# Altium schematic sheet Sheet.SchDoc
size A
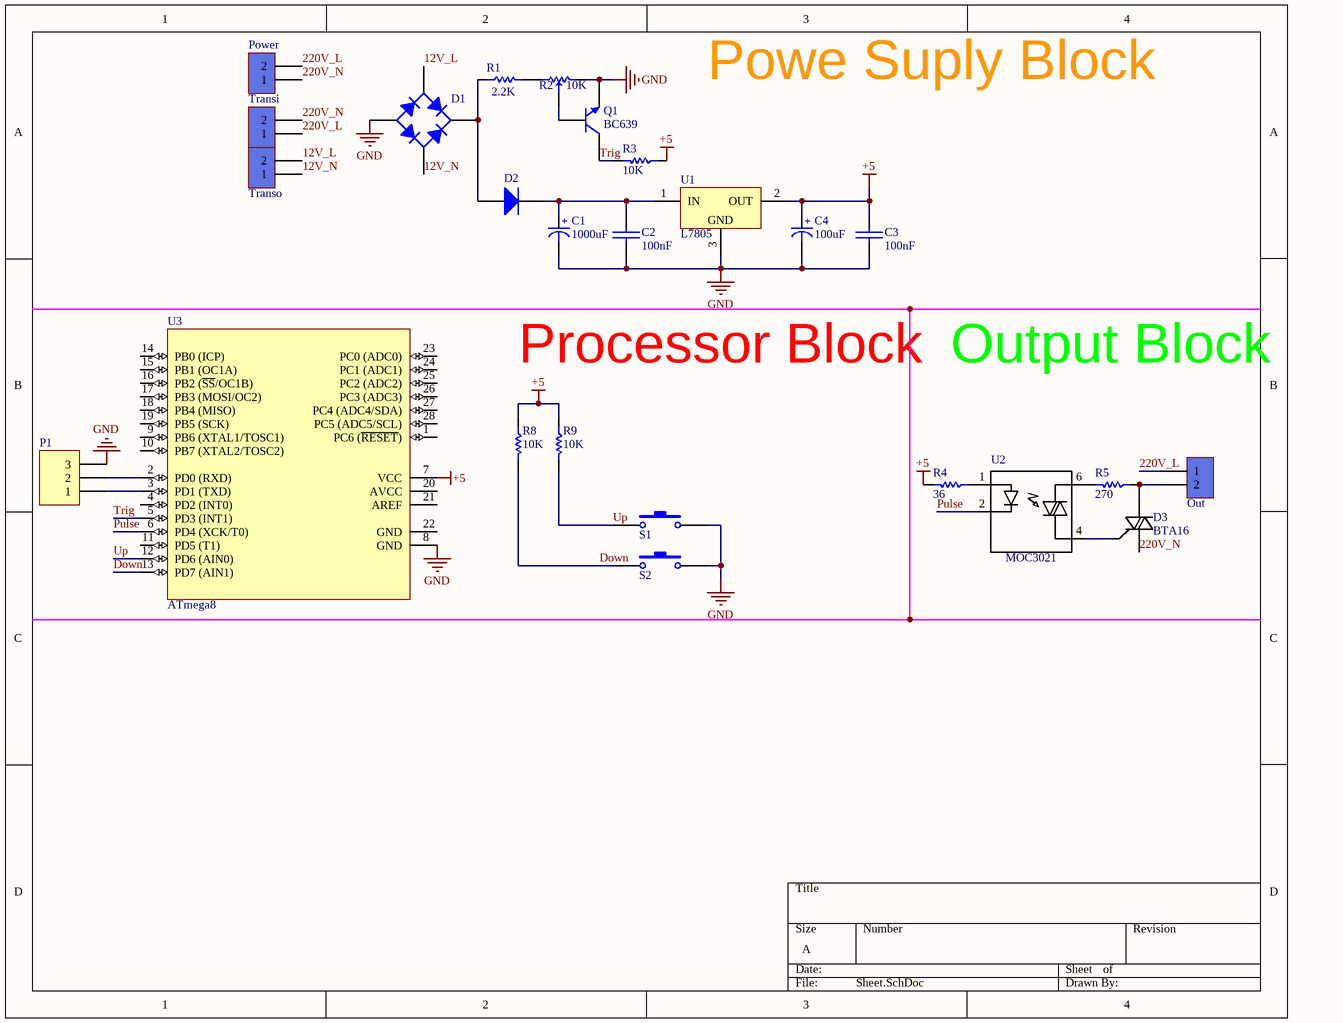
[diagram p0: Sheet.SchDoc]

## Parts
C1  1000uF  [cap 04]
C2  100nF  [Cap - 100nF]
C3  100nF  [Cap - 100nF]
C4  100uF  [cap 03]
D1  Diode Bridge  [Bridge]  (value not drawn)
D2  Diode 1N4007  [DO-41]  (value not drawn)
D3  BTA16  [*TO254P1028X482X1968-3]
Out  Terminal  [Terminal 1*2]  (value not drawn)
P1  MHDR1X3  [MHDR1X3]  (value not drawn)
Power  Terminal  [Terminal 1*2]  (value not drawn)
Q1  BC639  [C945]
R1  2.2K  [Res-(1/4)]
R2  10K  [Pot 00]
R3  10K  [Res-(1/4)]
R4  36  [Res-(1/4)]
R5  270  [Res-(1/4)]
R8  10K  [Res-(1/4)]
R9  10K  [Res-(1/4)]
S1  Switch PB  [Switch - Push to On]  (value not drawn)
S2  Switch PB  [Switch - Push to On]  (value not drawn)
Transi  Terminal  [Terminal 1*2]  (value not drawn)
Transo  Terminal  [Terminal 1*2]  (value not drawn)
U1  L7805  [78XXCV]
U2  MOC3021  [*DIP762W45P254L889H508Q6]
U3  ATmega8  [28P3]

## Nets
+5: C3.1(+) C4.1(+) R3.1 R4.2 R8.1 R9.1 U1.2(OUT) U3.7(VCC)
GND: C1.2(-) C2.2(-) C3.2(-) C4.2(-) D1.3(A) P1.3 Q1.1(E) R2.1(CCW) S1.2 S2.2 U1.3(GND) U3.8(GND)
12V_L: D1.4(C) Transo.2
12V_N: D1.2(C) Transo.1
220V_L: Out.1 Power.2 Transi.1
220V_N: D3.1(MT1) Power.1 Transi.2
Down: R8.2 S2.1 U3.13(PD7_(AIN1))
Pulse: U2.2(CATODE) U3.6(PD4_(XCK/T0))
Trig: Q1.2(C) R3.2 U3.5(PD3_(INT1))
Up: R9.2 S1.1 U3.12(PD6_(AIN0))
NetC1_1: C1.1(+) C2.1(+) D2.2(K) U1.1(IN)
NetD1_1: D1.1(K) D2.1(A) R1.1
NetD3_2: D3.2(MT2) Out.2 R5.1
NetD3_3: D3.3(G) U2.4(MAIN_TERM2)
NetP1_1: P1.1 U3.3(PD1_(TXD))
NetP1_2: P1.2 U3.2(PD0_(RXD))
NetQ1_3: Q1.3(B) R2.3(Setpoint)
NetR1_2: R1.2 R2.2(CW)
NetR4_1: R4.1 U2.1(ANODE)
NetR5_2: R5.2 U2.6(MAIN_TERM1)

Not connected (* = marked no-connect by the designer): U3 1(PC6_(~{RESET})) 4(PD2_(INT0)) 9(PB6_(XTAL1/TOSC1)) 10(PB7_(XTAL2/TOSC2)) 11(PD5_(T1)) 14(PB0_(ICP)) 15(PB1_(OC1A)) 16(PB2_(~{SS}/OC1B)) 17(PB3_(MOSI/OC2)) 18(PB4_(MISO)) 19(PB5_(SCK)) 20(AVCC) 21(AREF) 22(GND) 23(PC0_(ADC0)) 24(PC1_(ADC1)) 25(PC2_(ADC2)) 26(PC3_(ADC3)) 27(PC4_(ADC4/SDA)) 28(PC5_(ADC5/SCL))

## Notes on the sheet
- Powe Suply Block
- Processor Block
- Output Block

## Library data of the parts
C1 C4 = Cap-Polar: Polar Capacitor; Designer: Saeid Jorablo; Organazation: ControTec; Voltage: 25V; Adding Date: 1387/12/20
  C1: Value: 1000uF
  C4: Value: 100uF
C2 C3 = Cap-Bipolar: Bipolar Capacitor; Voltage: 100V; Designer: Saeid Jorablo; Organazation: ControTec; Adding Date: 1387/12/20; Value: 100nF
D1 = Diode Bridge: Full Wave Diode Bridge; Company: E.P.I.L; Design Date: 2011/11/02
D2 = Diode 1N4007: 1 Amp General Purpose Rectifier; Published: 8-Jun-2000; LatestRevisionDate: 17-Jul-2002; LatestRevisionNote: Re-released for DXP Platform.; DatasheetVersion: 1998; PackageVersion: Aug-1999; PackageReference: DO-41; Publisher: Altium Limited; PackageDescription: Diode, Axial; Body 5.2 x 2.7 mm (LxDia. max), Lead Dia. 0.86 mm (max); Code_JEDEC: DO-204-AL; ComponentLink1Description: Manufacturer Link; ComponentLink1URL: http://www.fairchildsemi.com/; ComponentLink2Description: Datasheet; ComponentLink2URL: http://www.fairchildsemi.com/ds/1N%2F1N4001.pdf
D3 = BTA16-600CW3G: Thyristor TRIAC 600V 170A 3-Pin_3+Tab_ TO-220AB Tube; MF: Littelfuse Inc.; Package: TO-220 Littelfuse; MP: BTA16-600CW3G; Availability: Unavailable; Price: None; SnapEDA_Link: https://www.snapeda.com/parts/BTA16-600CW3G/Littelfuse%20Inc./view-part/?ref=snap; Value: *
Out Power Transi Transo = Terminal 1*2: Terminal 2 Pin 250VAC 16A; Designer: Seyed Mohsen Ghasemain; E-mail: picpars@gmail.com; ComponentLinkURL: www.picpars.com
P1 = MHDR1X3: Header, 3-Pin; LatestRevisionDate: 17-Jul-2002; LatestRevisionNote: Re-released for DXP Platform.; Publisher: Altium Limited
Q1 = C945: NPN Transistor; Designer: Saeid Jorablo; Company: IPA CO; Last Update Time: 2008/08/04; Value: BC639
R1 R3-R5 R8 R9 = Resistor: Tolerance: 5%; Power: 1/8 W
  R1: Value: 2.2K
  R3 R8 R9: Value: 10K
  R4: Value: 36
  R5: Value: 270
R2 = Resistor Variable: Variable Resistor; Designer: Saeid Jorablo; Company: ControTec; Adding Date: 137/12/22; Value: 10K
S1 S2 = Switch PB: Push Button Switch
U1 = L78XXCV: Fixed Voltage Regulator; Designer: Saeid Jorablo; Company: ControTec; Adding Date: 1387/01/06; Voltage: *
U2 = MOC3021: Optoisolator Triac Output 5300Vrms 1 Channel 6-DIP; MF: ON Semiconductor; Price: None; SnapEDA_Link: https://www.snapeda.com/parts/MOC3021/ON%20Semiconductor/view-part/1666329/?ref=snap; MP: MOC3021; Availability: Unavailable; Package: DIP-6 Fujitsu; Value: *
U3 = ATmega8-16PC: 8-Bit AVR Microcontroller with 8K Bytes of In-System Programmable Flash Memory; Published: 17-Sep-2003; DatasheetVersion: 2486H-AVR-09/02; PackageVersion: revB, Sep-2001; PackageReference: 28P3; Publisher: Altium Limited; PackageDescription: 28-lead (0.300"/7.62mm Wide) Plastic Dual Inline Package (PDIP); Supplier 1: Digi-Key; Supplier Part Number 1: ATMEGA8-16PC-ND; Supplier 2: Mouser; Supplier Part Number 2: 556-ATMEGA8-16PC; ComponentLink1Description: Datasheet; ComponentLink1URL: http://www.atmel.com/dyn/resources/prod_documents/doc2486.pdf; ComponentLink2Description: Atmel.com Home; ComponentLink2URL: http://www.atmel.com